# EasyEDA schematic SCH_POC-DRV8835_2022-11-29.json
TITLE: POC_DRV8835; REV: 1.0; Date: 2022-11-25; Sheet: 1/1; Drawn By: milanvannieuwenhuyze; Company: HoGent
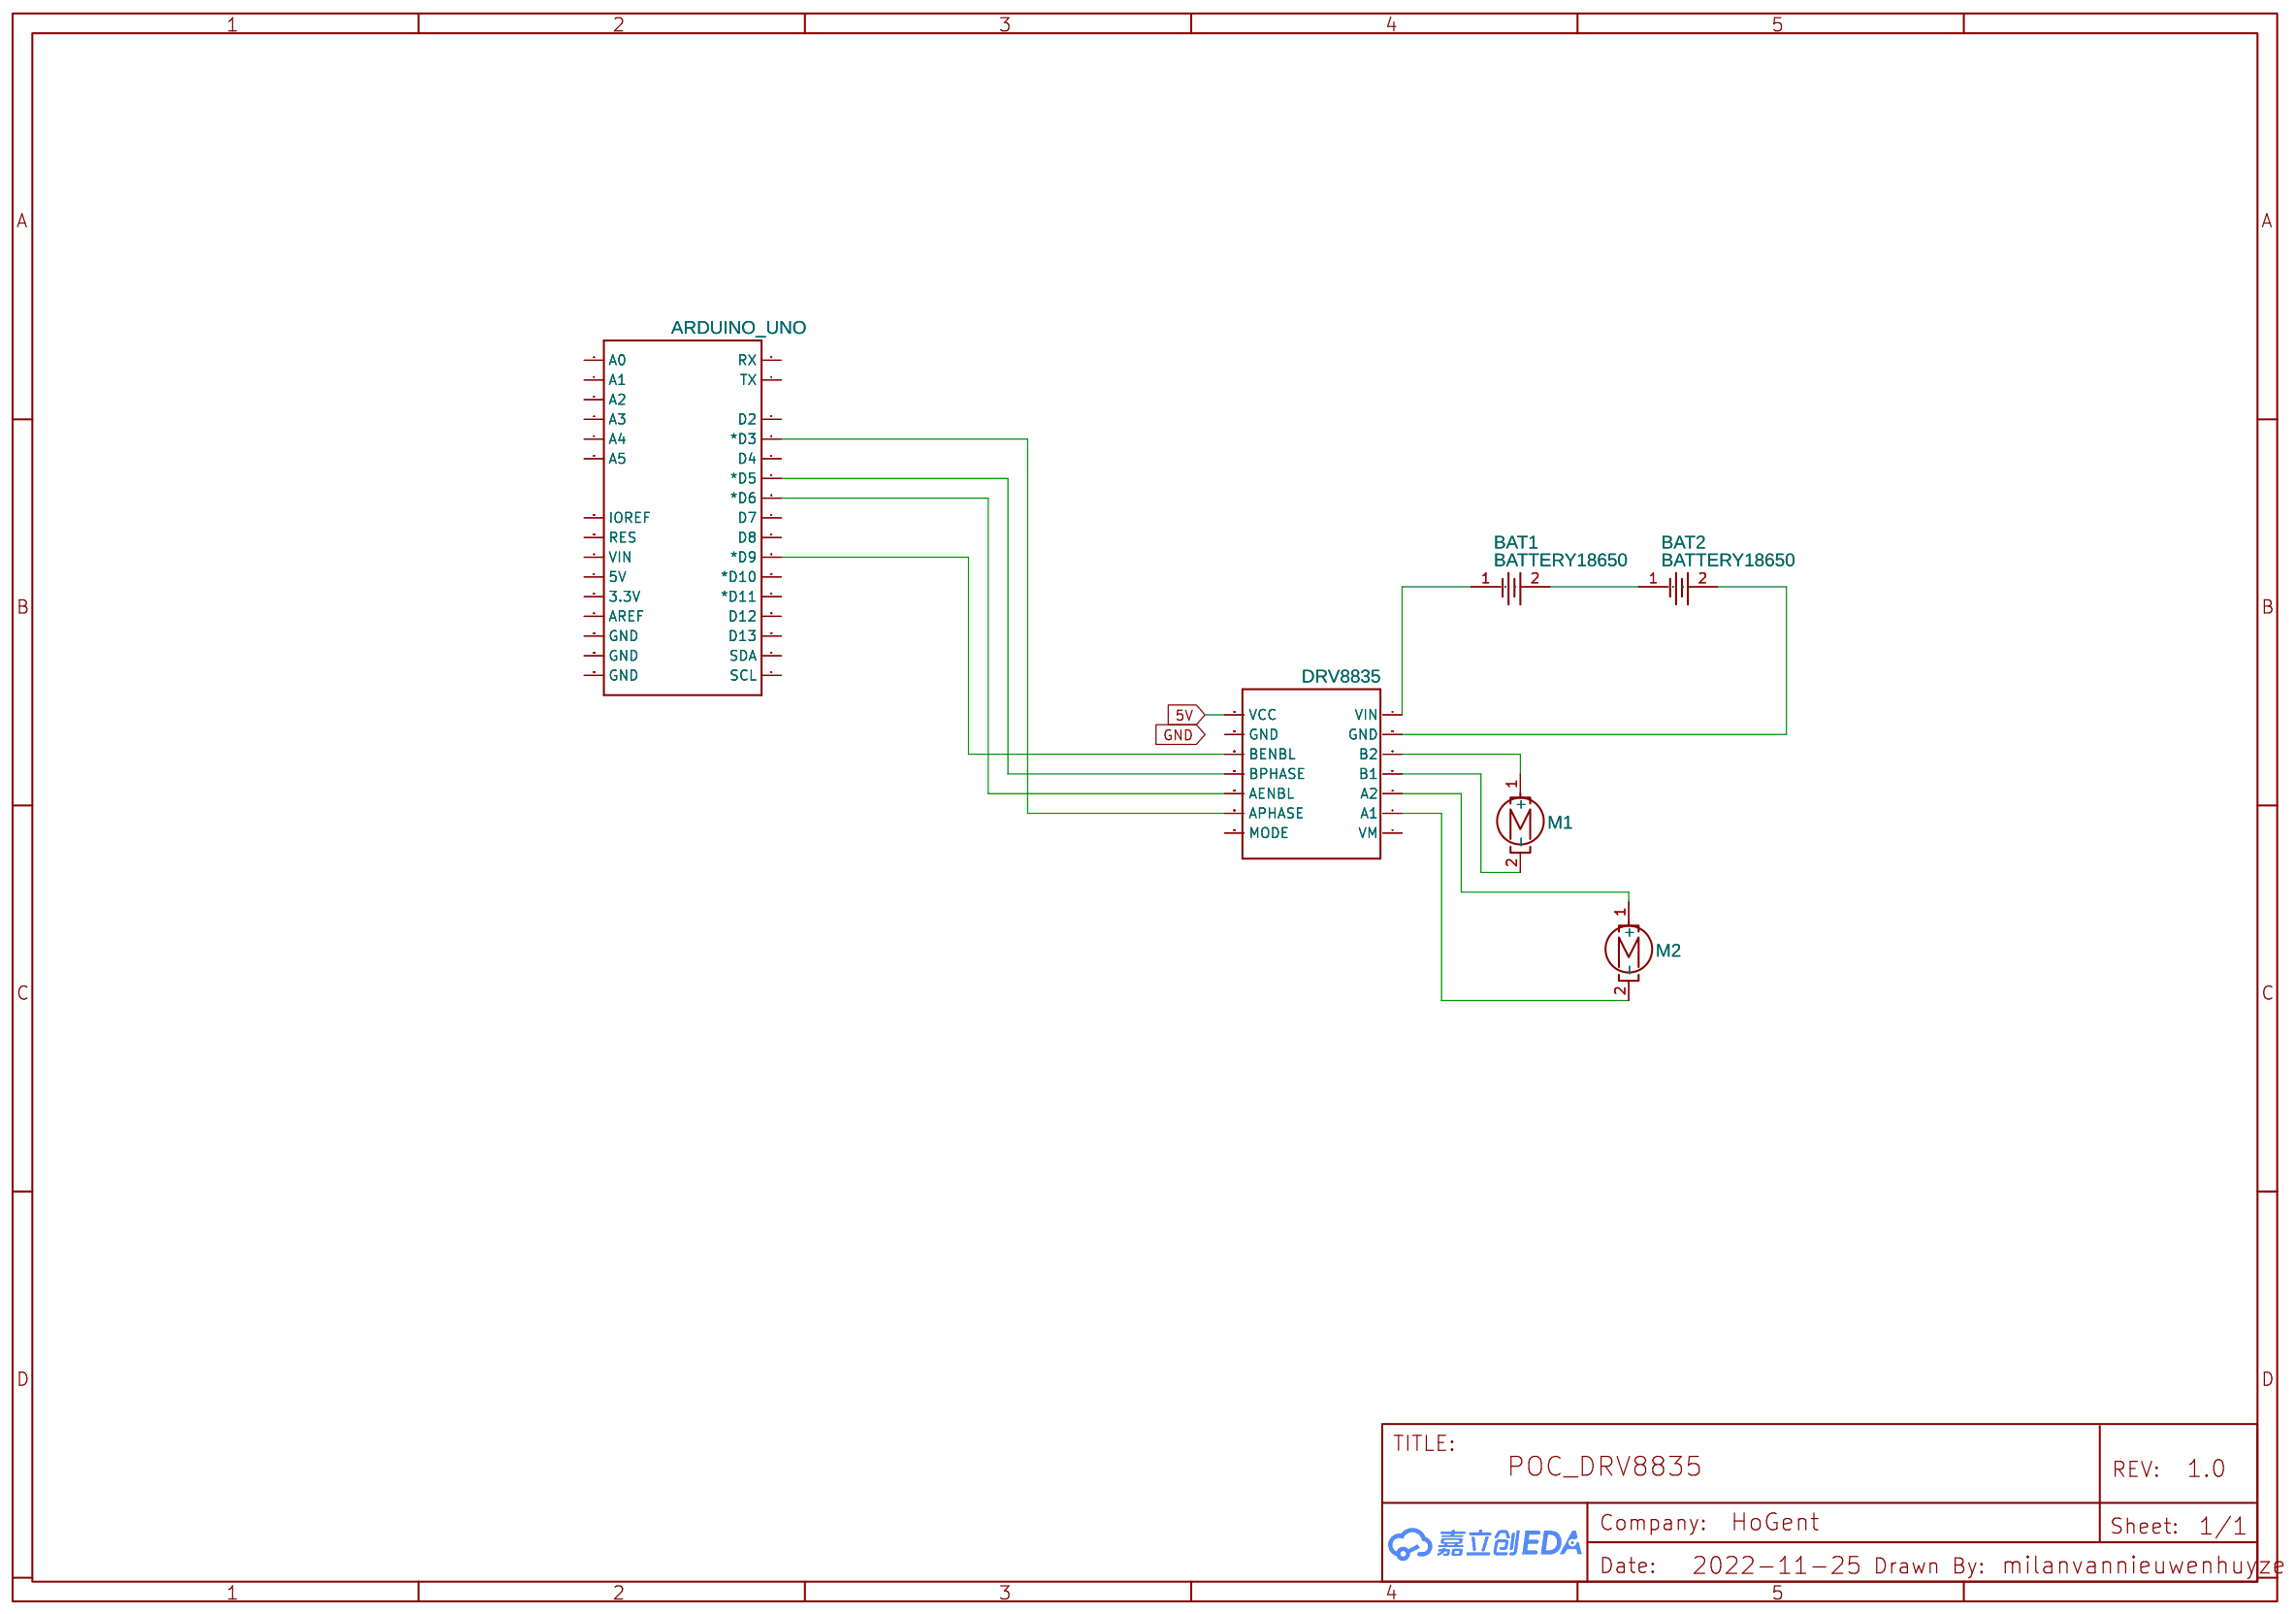
[diagram p0: schematic sheet]

## Parts
A2  DRV8835  [POLOLU_DRV8835]
BAT1  BATTERY18650  [BATTERY-SMD_18650-1S-L77.1-W20.7-1]
BAT2  BATTERY18650  [BATTERY-SMD_18650-1S-L77.1-W20.7-1]
M1  Motor_DC_ALT
M2  Motor_DC_ALT
U1  ARDUINO_UNO  [UNO_R3_SHIELD_NOLABELS]

## Library data of the parts
A2 = POLOLU_DRV8835: Contributor: dcunderlik123
BAT1 BAT2 = BH-18650-B1BA002: Supplier: LCSC; Supplier Part: C2988620; Manufacturer: MYOUNG(美阳); link: https://atta.szlcsc.com/upload/public/pdf/source/20220402/870DB99AB50CA0DF8D51CF7C86A51FAB.pdf; Contributor: lcsc; JLCPCB Part Class: Extended Part
M1 M2 = Motor_DC_ALT: Contributor: KiCAD; license: https://www.gnu.org/licenses/lgpl-2.1.html
U1 = ARDUINO_R3_SHIELD: Contributor: SparkFun

## Nets
5V: A2.VCC
Net-(A2-A1): A2.A1 M2.2(-)
Net-(A2-A2): A2.A2 M2.1(+)
Net-(A2-AENBL): A2.AENBL U1.D6(*D6)
Net-(A2-APHASE): A2.APHASE U1.D3(*D3)
Net-(A2-B1): A2.B1 M1.2(-)
Net-(A2-B2): A2.B2 M1.1(+)
Net-(A2-BENBL): A2.BENBL U1.D9(*D9)
Net-(A2-BPHASE): A2.BPHASE U1.D5(*D5)
Net-(A2-GND@2): A2.GND@2(GND) BAT2.2
Net-(A2-VIN): A2.VIN BAT1.1
Net-(BAT1-2): BAT1.2 BAT2.1

Not connected (* = marked no-connect by the designer): A2 GND@1(GND) MODE VM; U1 3.3V 5V A0 A1 A2 A3 A4 A5 AREF D2 D4 D7 D8 D10(*D10) D11(*D11) D12 D13 GND@0(GND) GND@1(GND) GND@2(GND) IOREF RES RX SCL SDA TX VIN
